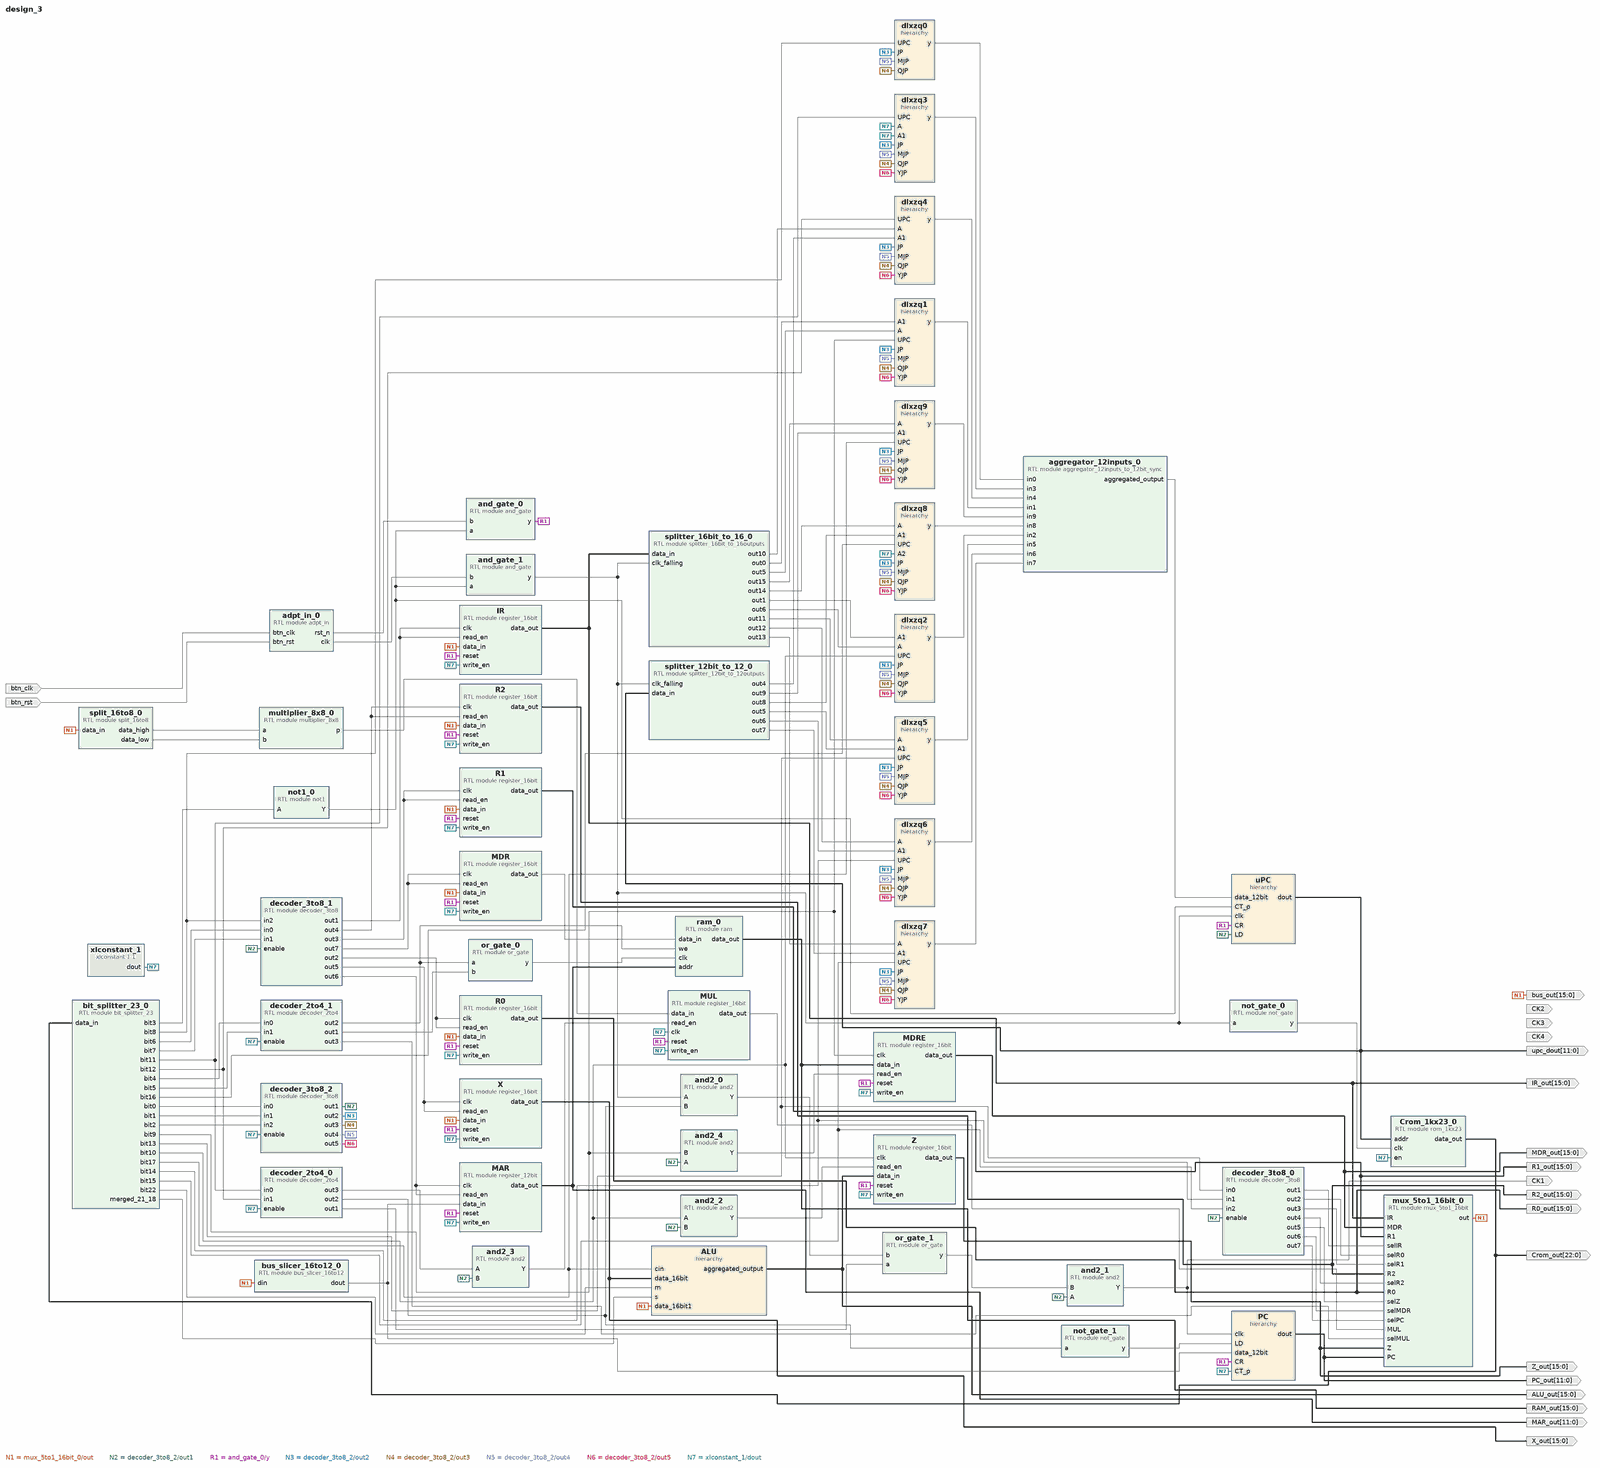
[diagram p0: block diagram of the top level, whole]
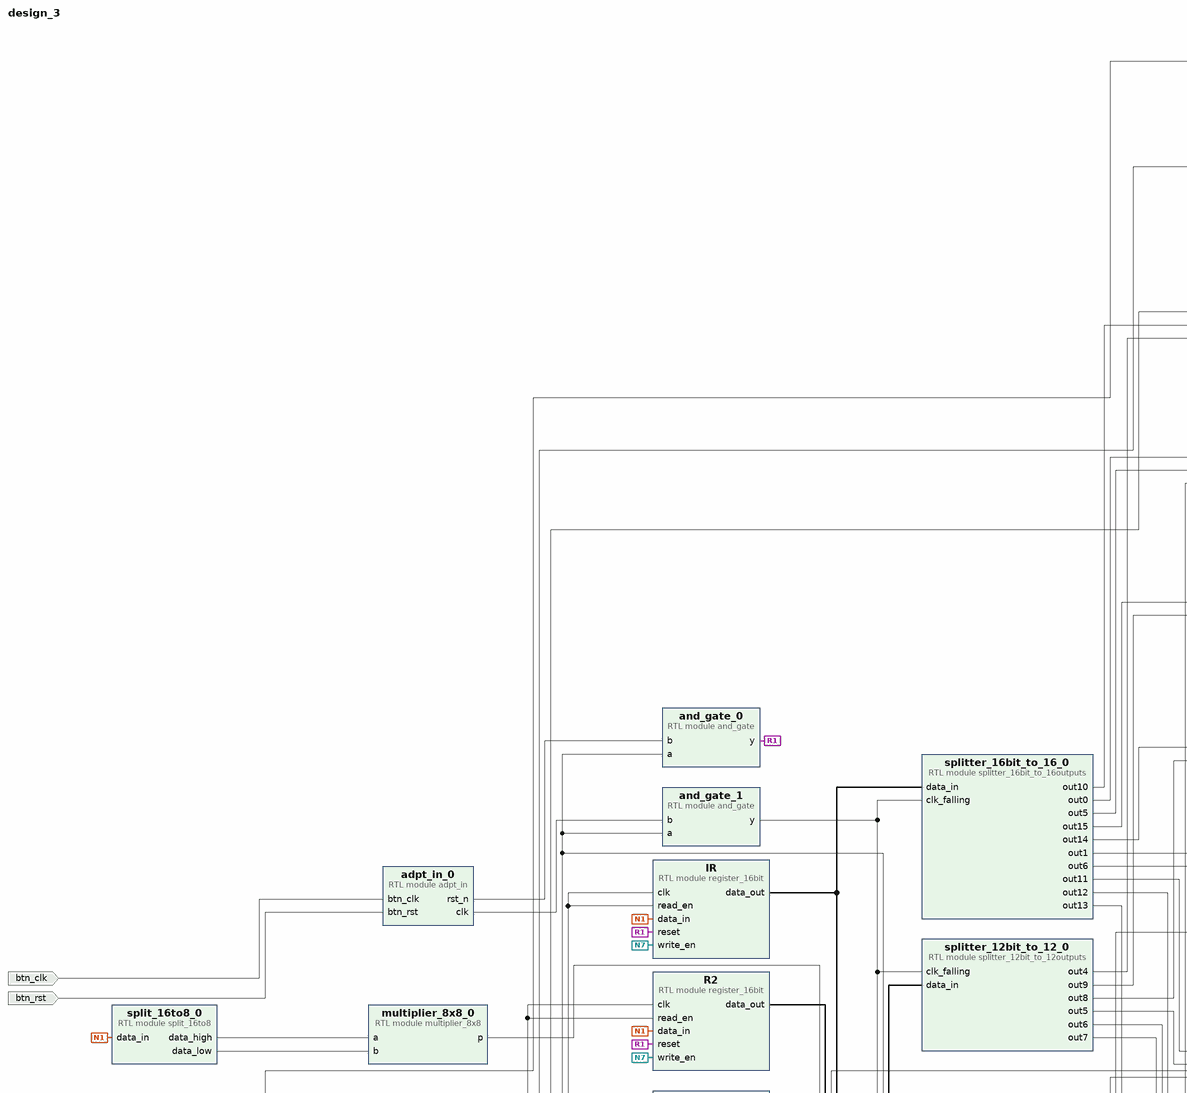
[diagram p1: block diagram of the top level, upper left part]
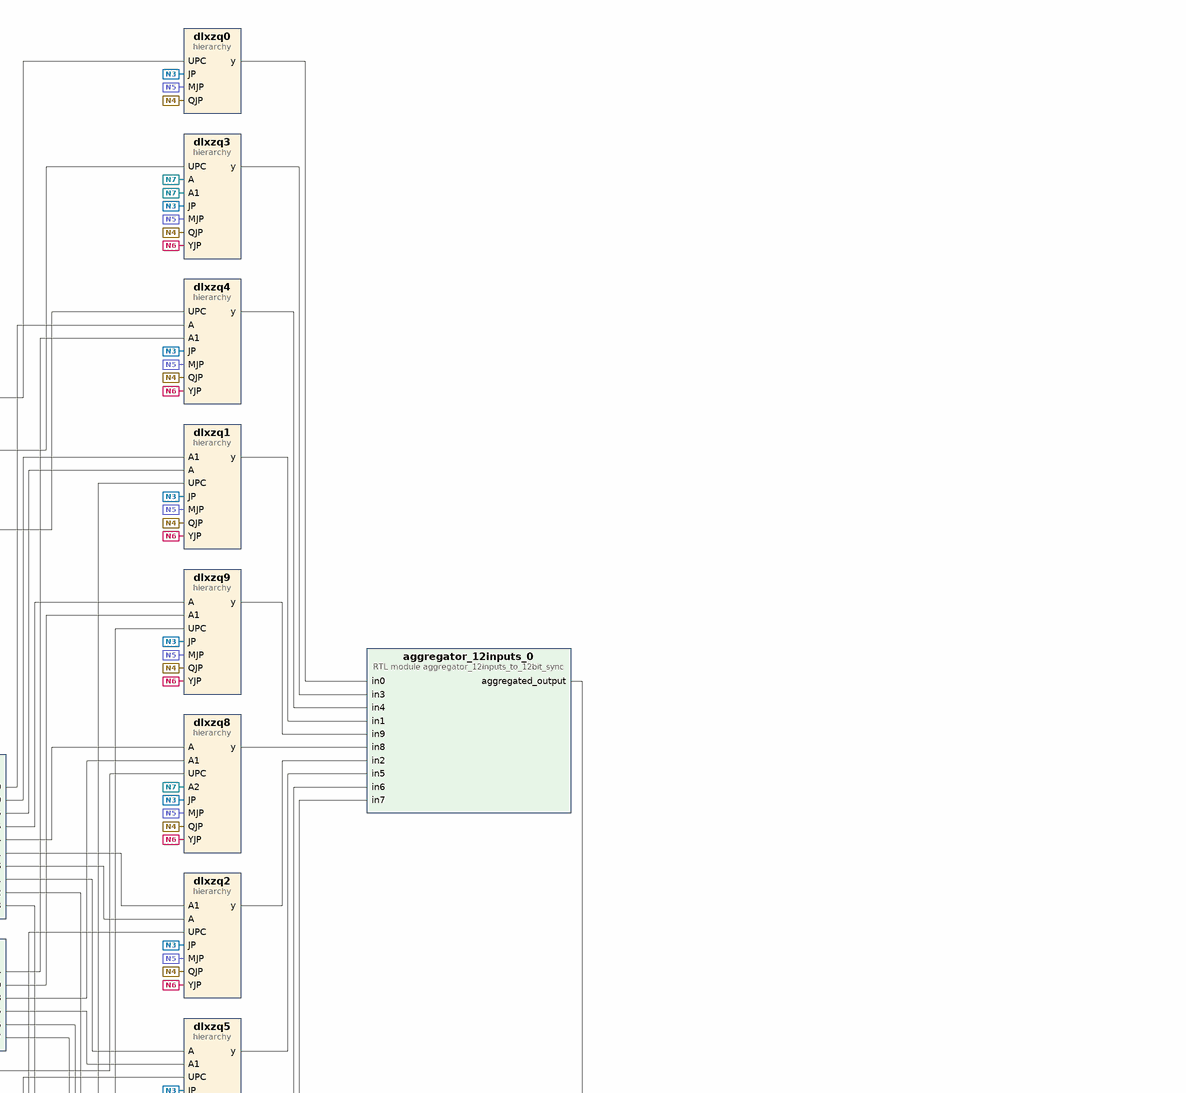
[diagram p2: block diagram of the top level, upper right part]
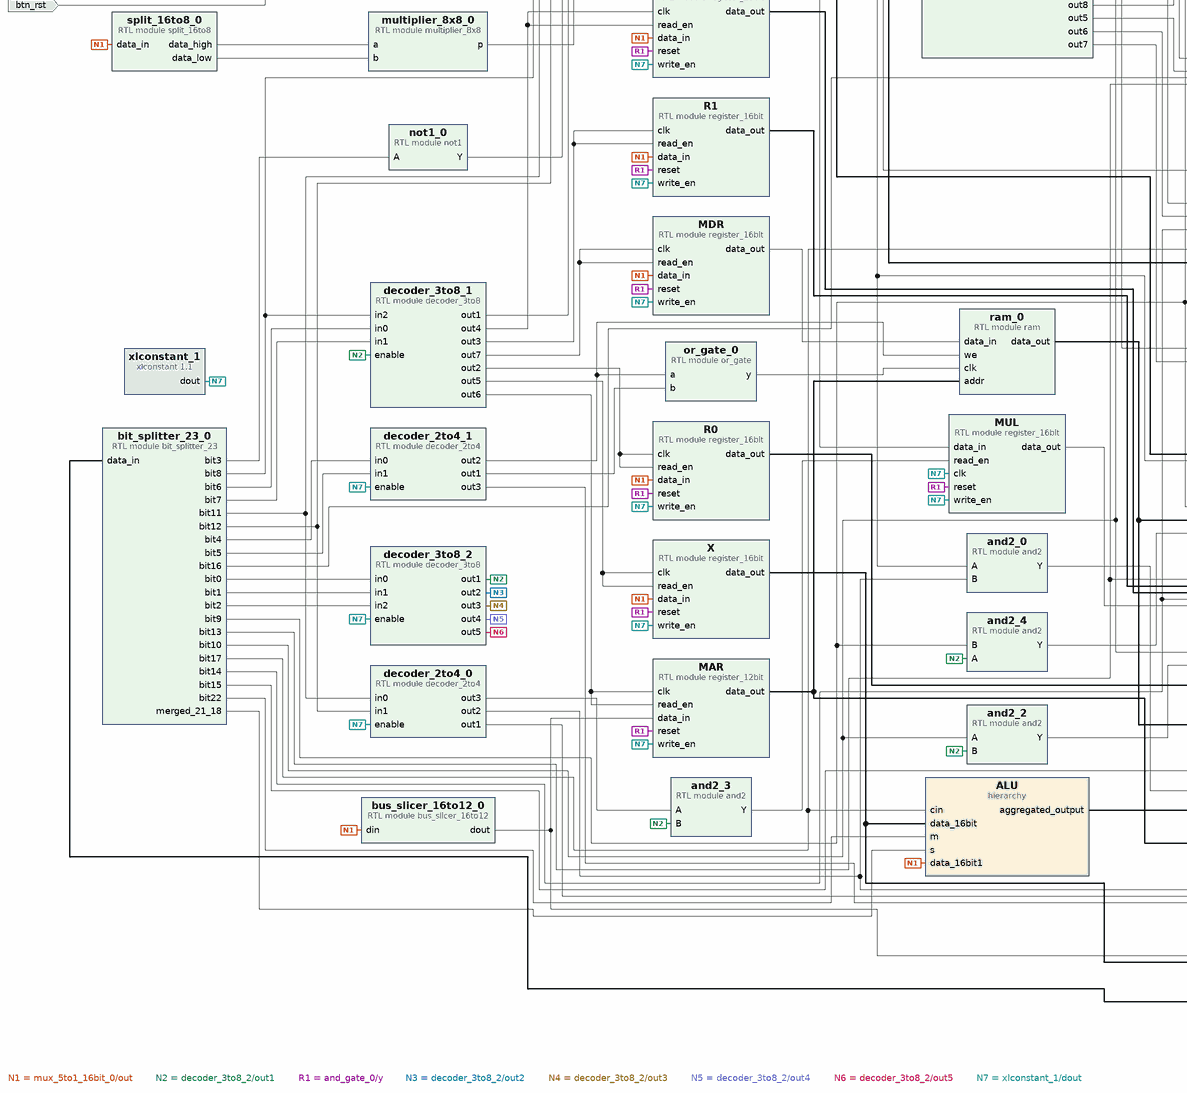
[diagram p3: block diagram of the top level, lower left part]
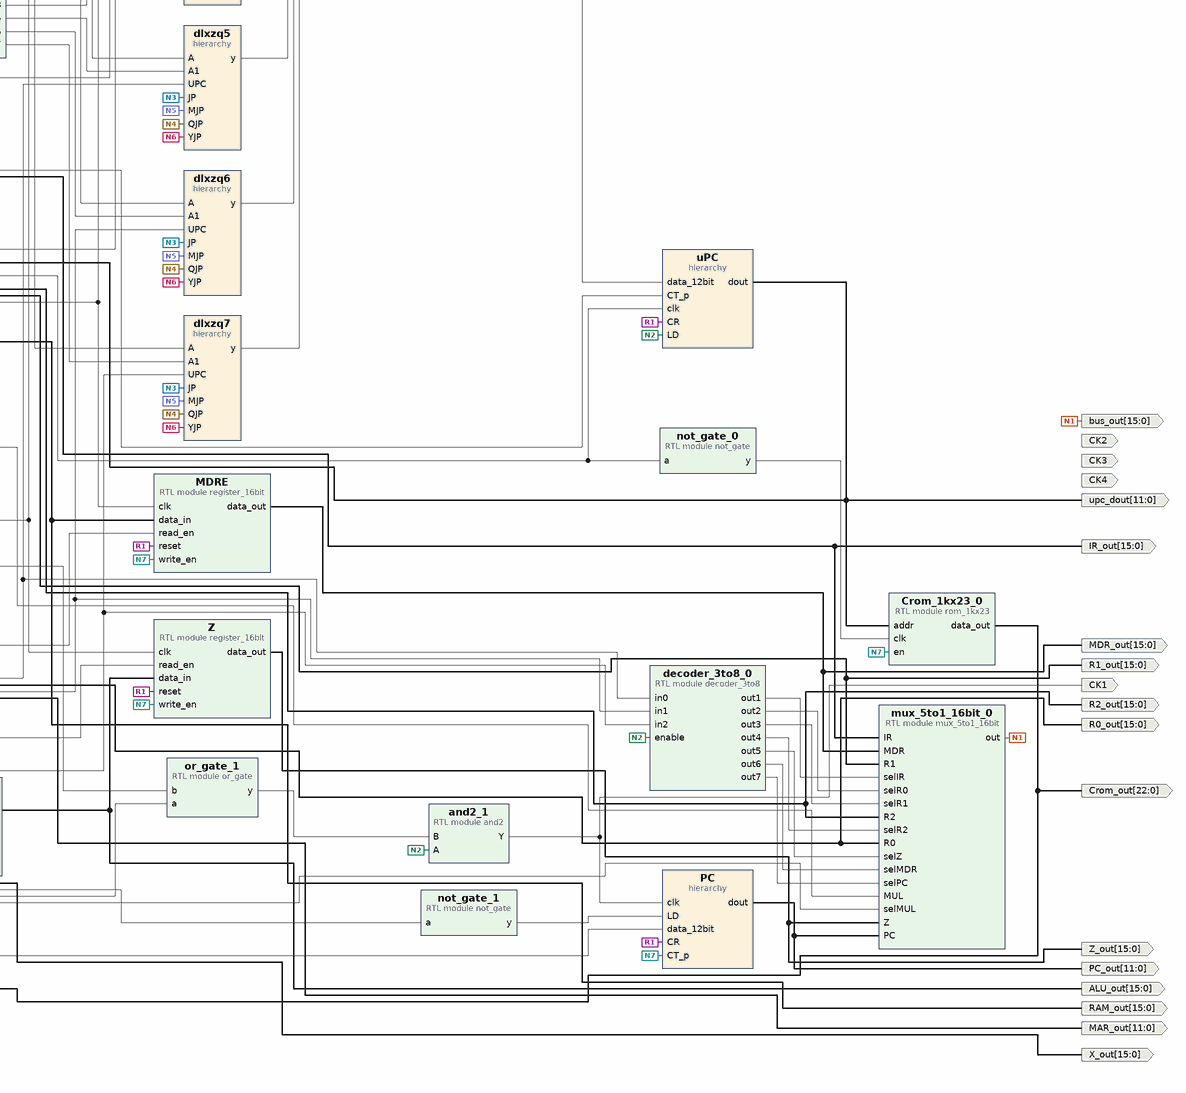
[diagram p4: block diagram of the top level, lower right part]
# Vivado block design design_3, xc7z020clg400-1, Vivado 2024.2
create_bd_design design_3

create_bd_port -dir I -type clk btn_clk
set_property -dict {CONFIG.FREQ_HZ 100000000} [get_bd_ports btn_clk]
create_bd_port -dir I -type rst btn_rst
create_bd_port -dir O -from 11 -to 0 upc_dout
create_bd_port -dir O -from 22 -to 0 Crom_out
create_bd_port -dir O -from 15 -to 0 bus_out
create_bd_port -dir O -from 11 -to 0 MAR_out
create_bd_port -dir O -from 11 -to 0 PC_out
create_bd_port -dir O -from 15 -to 0 RAM_out
create_bd_port -dir O -from 15 -to 0 IR_out
create_bd_port -dir O -from 15 -to 0 R2_out
create_bd_port -dir O -from 15 -to 0 R0_out
create_bd_port -dir O -from 15 -to 0 MDR_out
create_bd_port -dir O -from 15 -to 0 R1_out
create_bd_port -dir O -from 15 -to 0 X_out
create_bd_port -dir O CK1
create_bd_port -dir O -from 15 -to 0 ALU_out
create_bd_port -dir O CK2
create_bd_port -dir O CK3
create_bd_port -dir O CK4
create_bd_port -dir O -from 15 -to 0 Z_out

create_bd_cell -type module -reference adpt_in adpt_in_0
create_bd_cell -type ip -vlnv xilinx.com:ip:xlconstant:1.1 xlconstant_1
create_bd_cell -type hier PC
create_bd_cell -type module -reference ram ram_0
create_bd_cell -type module -reference register_16bit R0
create_bd_cell -type module -reference register_16bit R1
create_bd_cell -type module -reference register_16bit R2
create_bd_cell -type module -reference register_16bit X
create_bd_cell -type module -reference register_16bit Z
create_bd_cell -type module -reference register_12bit MAR
create_bd_cell -type module -reference register_16bit MDR
create_bd_cell -type module -reference register_16bit MDRE
create_bd_cell -type module -reference register_16bit IR
create_bd_cell -type module -reference mux_5to1_16bit mux_5to1_16bit_0
create_bd_cell -type hier ALU
create_bd_cell -type hier uPC
create_bd_cell -type module -reference rom_1kx23 Crom_1kx23_0
create_bd_cell -type module -reference bit_splitter_23 bit_splitter_23_0
create_bd_cell -type module -reference decoder_3to8 decoder_3to8_0
create_bd_cell -type module -reference decoder_2to4 decoder_2to4_0
create_bd_cell -type module -reference decoder_3to8 decoder_3to8_1
create_bd_cell -type module -reference decoder_2to4 decoder_2to4_1
create_bd_cell -type module -reference not1 not1_0
create_bd_cell -type module -reference decoder_3to8 decoder_3to8_2
create_bd_cell -type hier dlxzq0
create_bd_cell -type hier dlxzq1
create_bd_cell -type hier dlxzq2
create_bd_cell -type hier dlxzq3
create_bd_cell -type hier dlxzq4
create_bd_cell -type hier dlxzq5
create_bd_cell -type hier dlxzq6
create_bd_cell -type hier dlxzq7
create_bd_cell -type hier dlxzq8
create_bd_cell -type hier dlxzq9
create_bd_cell -type module -reference aggregator_12inputs_to_12bit_sync aggregator_12inputs_0
create_bd_cell -type module -reference splitter_16bit_to_16outputs splitter_16bit_to_16_0
create_bd_cell -type module -reference not_gate not_gate_0
create_bd_cell -type module -reference bus_slicer_16to12 bus_slicer_16to12_0
create_bd_cell -type module -reference or_gate or_gate_0
create_bd_cell -type module -reference and_gate and_gate_0
create_bd_cell -type module -reference and_gate and_gate_1
create_bd_cell -type module -reference not_gate not_gate_1
create_bd_cell -type module -reference or_gate or_gate_1
create_bd_cell -type module -reference and2 and2_0
create_bd_cell -type module -reference splitter_12bit_to_12outputs splitter_12bit_to_12_0
create_bd_cell -type module -reference and2 and2_1
create_bd_cell -type module -reference and2 and2_2
create_bd_cell -type module -reference multiplier_8x8 multiplier_8x8_0
create_bd_cell -type module -reference split_16to8 split_16to8_0
create_bd_cell -type module -reference register_16bit MUL
create_bd_cell -type module -reference and2 and2_3
create_bd_cell -type module -reference and2 and2_4

# ---- hierarchy /PC ----
current_bd_instance /PC
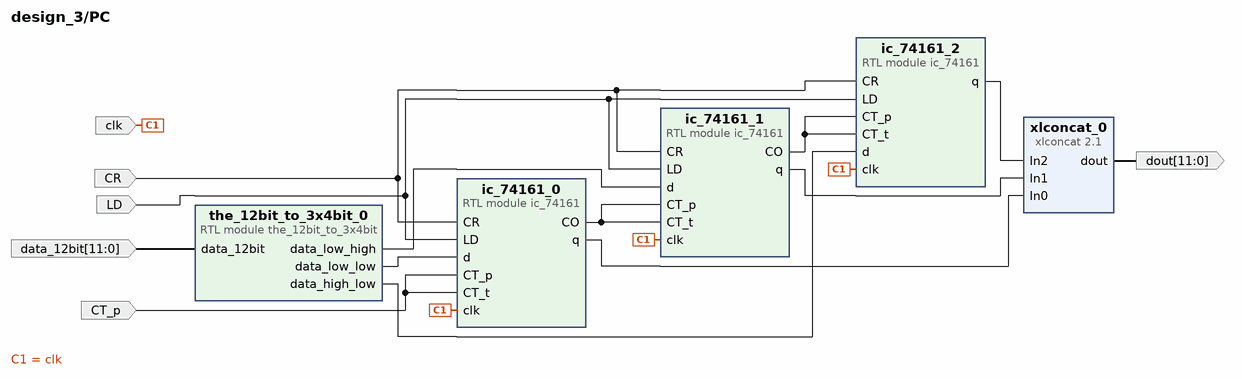
[diagram p5: block diagram inside /PC]
create_bd_pin -dir I CT_p
create_bd_pin -dir O -from 11 -to 0 dout
create_bd_pin -dir I -type clk clk
create_bd_pin -dir I CR
create_bd_pin -dir I -from 11 -to 0 data_12bit
create_bd_pin -dir I LD

create_bd_cell -type module -reference ic_74161 ic_74161_0
create_bd_cell -type module -reference ic_74161 ic_74161_1
create_bd_cell -type module -reference ic_74161 ic_74161_2
create_bd_cell -type ip -vlnv xilinx.com:ip:xlconcat:2.1 xlconcat_0
set_property -dict [list \
  CONFIG.IN0_WIDTH 4 \
  CONFIG.IN1_WIDTH 4 \
  CONFIG.IN2_WIDTH 4 \
  CONFIG.IN3_WIDTH 4 \
  CONFIG.NUM_PORTS 3 \
] [get_bd_cells xlconcat_0]
create_bd_cell -type module -reference the_12bit_to_3x4bit the_12bit_to_3x4bit_0

# ---- hierarchy /ALU ----
current_bd_instance /ALU
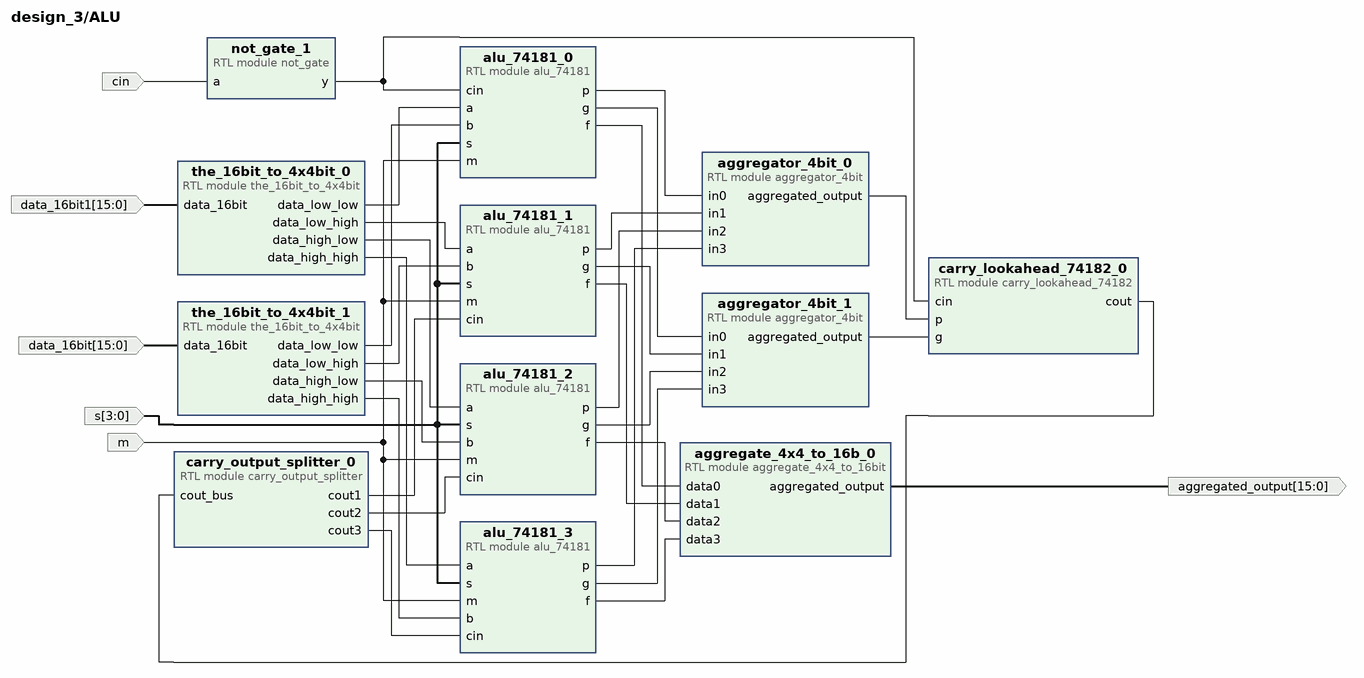
[diagram p6: block diagram inside /ALU]
create_bd_pin -dir I -from 15 -to 0 data_16bit
create_bd_pin -dir I -from 15 -to 0 data_16bit1
create_bd_pin -dir O -from 15 -to 0 aggregated_output
create_bd_pin -dir I m
create_bd_pin -dir I -from 3 -to 0 s
create_bd_pin -dir I cin

create_bd_cell -type module -reference aggregator_4bit aggregator_4bit_0
create_bd_cell -type module -reference carry_lookahead_74182 carry_lookahead_74182_0
create_bd_cell -type module -reference aggregator_4bit aggregator_4bit_1
create_bd_cell -type module -reference alu_74181 alu_74181_0
create_bd_cell -type module -reference alu_74181 alu_74181_1
create_bd_cell -type module -reference alu_74181 alu_74181_2
create_bd_cell -type module -reference aggregate_4x4_to_16bit aggregate_4x4_to_16b_0
create_bd_cell -type module -reference the_16bit_to_4x4bit the_16bit_to_4x4bit_1
create_bd_cell -type module -reference the_16bit_to_4x4bit the_16bit_to_4x4bit_0
create_bd_cell -type module -reference alu_74181 alu_74181_3
create_bd_cell -type module -reference carry_output_splitter carry_output_splitter_0
create_bd_cell -type module -reference not_gate not_gate_1

# ---- hierarchy /uPC ----
current_bd_instance /uPC
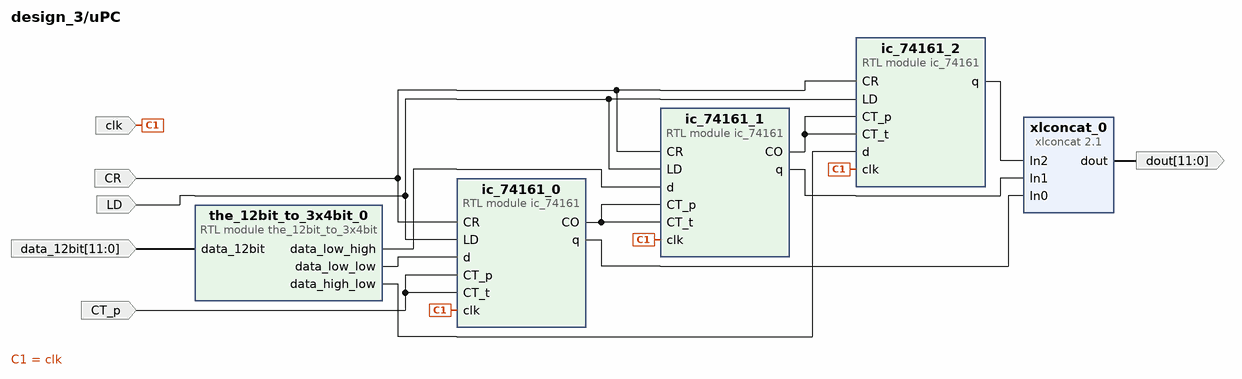
[diagram p7: block diagram inside /uPC]
create_bd_pin -dir I -type clk clk
create_bd_pin -dir I CT_p
create_bd_pin -dir O -from 11 -to 0 dout
create_bd_pin -dir I LD
create_bd_pin -dir I -from 11 -to 0 data_12bit
create_bd_pin -dir I CR

create_bd_cell -type module -reference ic_74161 ic_74161_0
create_bd_cell -type module -reference ic_74161 ic_74161_1
create_bd_cell -type module -reference ic_74161 ic_74161_2
create_bd_cell -type ip -vlnv xilinx.com:ip:xlconcat:2.1 xlconcat_0
set_property -dict [list \
  CONFIG.IN0_WIDTH 4 \
  CONFIG.IN1_WIDTH 4 \
  CONFIG.IN2_WIDTH 4 \
  CONFIG.IN3_WIDTH 4 \
  CONFIG.NUM_PORTS 3 \
] [get_bd_cells xlconcat_0]
create_bd_cell -type module -reference the_12bit_to_3x4bit the_12bit_to_3x4bit_0

# ---- hierarchy /dlxzq0 ----
current_bd_instance /dlxzq0
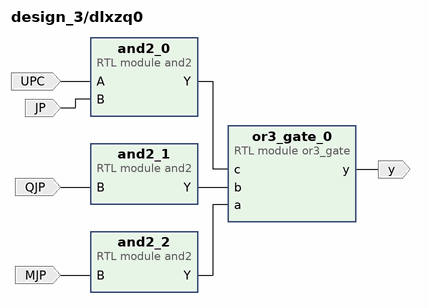
[diagram p8: block diagram inside /dlxzq0]
create_bd_pin -dir I QJP
create_bd_pin -dir I MJP
create_bd_pin -dir I UPC
create_bd_pin -dir I JP
create_bd_pin -dir O y

create_bd_cell -type module -reference and2 and2_1
create_bd_cell -type module -reference and2 and2_2
create_bd_cell -type module -reference or3_gate or3_gate_0
create_bd_cell -type module -reference and2 and2_0

# ---- hierarchy /dlxzq1 ----
current_bd_instance /dlxzq1
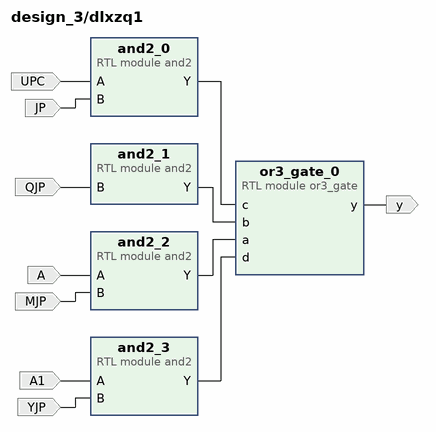
[diagram p9: block diagram inside /dlxzq1]
create_bd_pin -dir I QJP
create_bd_pin -dir I MJP
create_bd_pin -dir I UPC
create_bd_pin -dir I JP
create_bd_pin -dir O y
create_bd_pin -dir I A
create_bd_pin -dir I YJP
create_bd_pin -dir I A1

create_bd_cell -type module -reference and2 and2_1
create_bd_cell -type module -reference and2 and2_2
create_bd_cell -type module -reference or3_gate or3_gate_0
create_bd_cell -type module -reference and2 and2_0
create_bd_cell -type module -reference and2 and2_3

# ---- hierarchy /dlxzq2 ----
current_bd_instance /dlxzq2
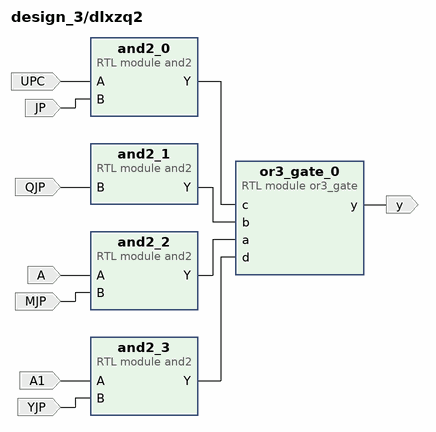
[diagram p10: block diagram inside /dlxzq2]
create_bd_pin -dir I QJP
create_bd_pin -dir I MJP
create_bd_pin -dir I UPC
create_bd_pin -dir I JP
create_bd_pin -dir O y
create_bd_pin -dir I A
create_bd_pin -dir I YJP
create_bd_pin -dir I A1

create_bd_cell -type module -reference and2 and2_1
create_bd_cell -type module -reference and2 and2_2
create_bd_cell -type module -reference or3_gate or3_gate_0
create_bd_cell -type module -reference and2 and2_0
create_bd_cell -type module -reference and2 and2_3

# ---- hierarchy /dlxzq3 ----
current_bd_instance /dlxzq3
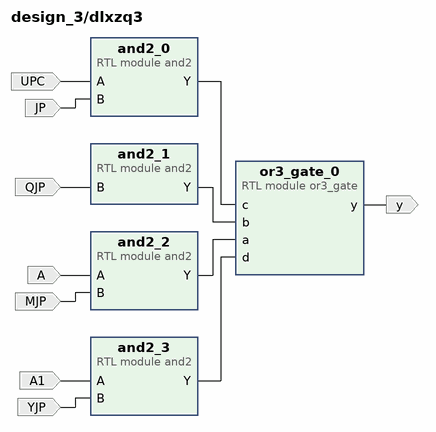
[diagram p11: block diagram inside /dlxzq3]
create_bd_pin -dir I QJP
create_bd_pin -dir I MJP
create_bd_pin -dir I UPC
create_bd_pin -dir I JP
create_bd_pin -dir O y
create_bd_pin -dir I A
create_bd_pin -dir I YJP
create_bd_pin -dir I A1

create_bd_cell -type module -reference and2 and2_1
create_bd_cell -type module -reference and2 and2_2
create_bd_cell -type module -reference or3_gate or3_gate_0
create_bd_cell -type module -reference and2 and2_0
create_bd_cell -type module -reference and2 and2_3

# ---- hierarchy /dlxzq4 ----
current_bd_instance /dlxzq4
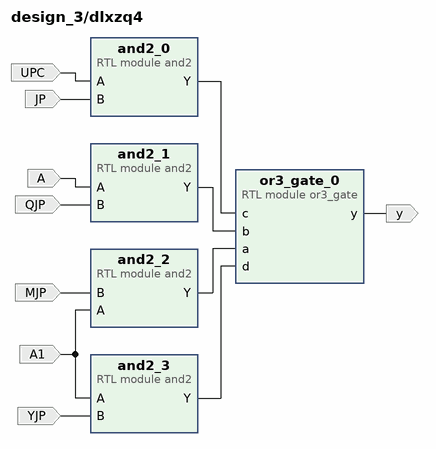
[diagram p12: block diagram inside /dlxzq4]
create_bd_pin -dir I QJP
create_bd_pin -dir I MJP
create_bd_pin -dir I UPC
create_bd_pin -dir I JP
create_bd_pin -dir O y
create_bd_pin -dir I A
create_bd_pin -dir I A1
create_bd_pin -dir I YJP

create_bd_cell -type module -reference and2 and2_1
create_bd_cell -type module -reference and2 and2_2
create_bd_cell -type module -reference or3_gate or3_gate_0
create_bd_cell -type module -reference and2 and2_0
create_bd_cell -type module -reference and2 and2_3

# ---- hierarchy /dlxzq5 ----
current_bd_instance /dlxzq5
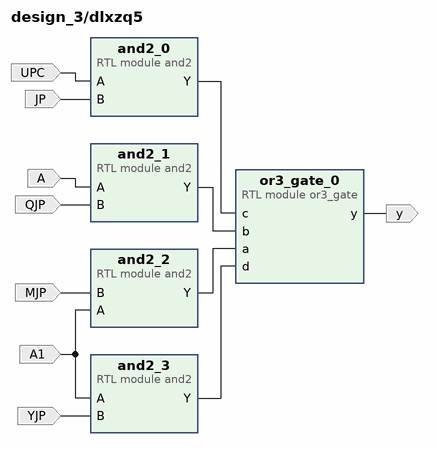
[diagram p13: block diagram inside /dlxzq5]
create_bd_pin -dir I QJP
create_bd_pin -dir I MJP
create_bd_pin -dir I UPC
create_bd_pin -dir I JP
create_bd_pin -dir O y
create_bd_pin -dir I A
create_bd_pin -dir I A1
create_bd_pin -dir I YJP

create_bd_cell -type module -reference and2 and2_1
create_bd_cell -type module -reference and2 and2_2
create_bd_cell -type module -reference or3_gate or3_gate_0
create_bd_cell -type module -reference and2 and2_0
create_bd_cell -type module -reference and2 and2_3

# ---- hierarchy /dlxzq6 ----
current_bd_instance /dlxzq6
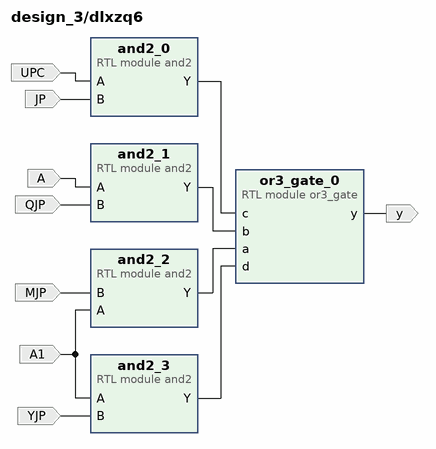
[diagram p14: block diagram inside /dlxzq6]
create_bd_pin -dir I QJP
create_bd_pin -dir I MJP
create_bd_pin -dir I UPC
create_bd_pin -dir I JP
create_bd_pin -dir O y
create_bd_pin -dir I A
create_bd_pin -dir I A1
create_bd_pin -dir I YJP

create_bd_cell -type module -reference and2 and2_1
create_bd_cell -type module -reference and2 and2_2
create_bd_cell -type module -reference or3_gate or3_gate_0
create_bd_cell -type module -reference and2 and2_0
create_bd_cell -type module -reference and2 and2_3

# ---- hierarchy /dlxzq7 ----
current_bd_instance /dlxzq7
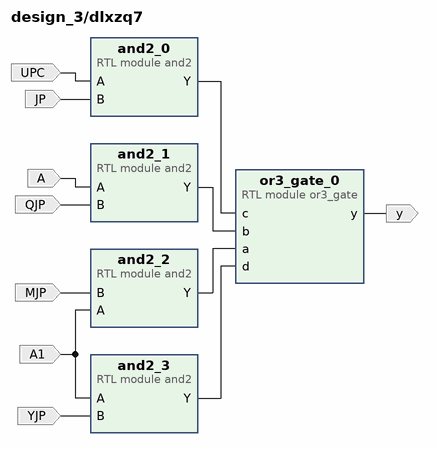
[diagram p15: block diagram inside /dlxzq7]
create_bd_pin -dir I QJP
create_bd_pin -dir I MJP
create_bd_pin -dir I UPC
create_bd_pin -dir I JP
create_bd_pin -dir O y
create_bd_pin -dir I A
create_bd_pin -dir I A1
create_bd_pin -dir I YJP

create_bd_cell -type module -reference and2 and2_1
create_bd_cell -type module -reference and2 and2_2
create_bd_cell -type module -reference or3_gate or3_gate_0
create_bd_cell -type module -reference and2 and2_0
create_bd_cell -type module -reference and2 and2_3

# ---- hierarchy /dlxzq8 ----
current_bd_instance /dlxzq8
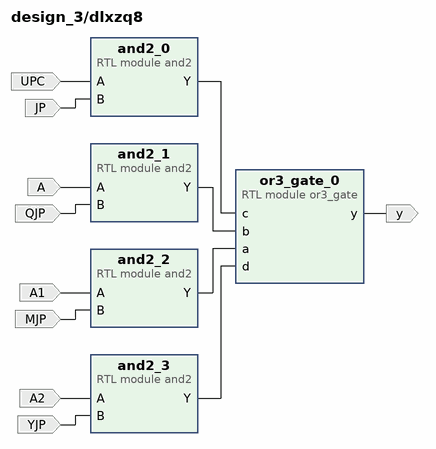
[diagram p16: block diagram inside /dlxzq8]
create_bd_pin -dir I QJP
create_bd_pin -dir I MJP
create_bd_pin -dir I UPC
create_bd_pin -dir I JP
create_bd_pin -dir O y
create_bd_pin -dir I A
create_bd_pin -dir I A1
create_bd_pin -dir I YJP
create_bd_pin -dir I A2

create_bd_cell -type module -reference and2 and2_1
create_bd_cell -type module -reference and2 and2_2
create_bd_cell -type module -reference or3_gate or3_gate_0
create_bd_cell -type module -reference and2 and2_0
create_bd_cell -type module -reference and2 and2_3

# ---- hierarchy /dlxzq9 ----
current_bd_instance /dlxzq9
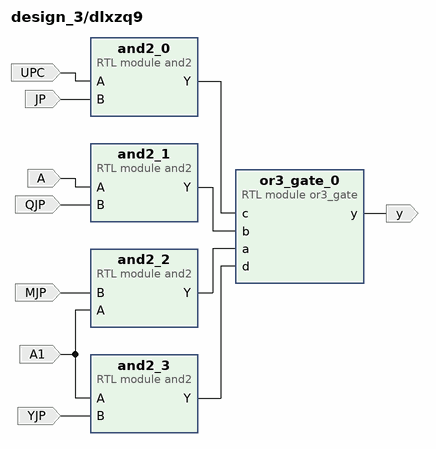
[diagram p17: block diagram inside /dlxzq9]
create_bd_pin -dir I QJP
create_bd_pin -dir I MJP
create_bd_pin -dir I UPC
create_bd_pin -dir I JP
create_bd_pin -dir O y
create_bd_pin -dir I A
create_bd_pin -dir I A1
create_bd_pin -dir I YJP

create_bd_cell -type module -reference and2 and2_1
create_bd_cell -type module -reference and2 and2_2
create_bd_cell -type module -reference or3_gate or3_gate_0
create_bd_cell -type module -reference and2 and2_0
create_bd_cell -type module -reference and2 and2_3

# ---- connections ----

current_bd_instance /PC
connect_bd_net [get_bd_pins CR] [get_bd_pins ic_74161_0/CR] [get_bd_pins ic_74161_1/CR] [get_bd_pins ic_74161_2/CR]
connect_bd_net [get_bd_pins LD] [get_bd_pins ic_74161_1/LD] [get_bd_pins ic_74161_2/LD] [get_bd_pins ic_74161_0/LD]
connect_bd_net -net adpt_in_0_clk [get_bd_pins clk] [get_bd_pins ic_74161_0/clk] [get_bd_pins ic_74161_1/clk] [get_bd_pins ic_74161_2/clk]
connect_bd_net [get_bd_pins data_12bit] [get_bd_pins the_12bit_to_3x4bit_0/data_12bit]
connect_bd_net [get_bd_pins ic_74161_0/CO] [get_bd_pins ic_74161_1/CT_p] [get_bd_pins ic_74161_1/CT_t]
connect_bd_net [get_bd_pins ic_74161_0/q] [get_bd_pins xlconcat_0/In0]
connect_bd_net [get_bd_pins ic_74161_1/CO] [get_bd_pins ic_74161_2/CT_p] [get_bd_pins ic_74161_2/CT_t]
connect_bd_net [get_bd_pins ic_74161_1/q] [get_bd_pins xlconcat_0/In1]
connect_bd_net [get_bd_pins ic_74161_2/q] [get_bd_pins xlconcat_0/In2]
connect_bd_net [get_bd_pins the_12bit_to_3x4bit_0/data_high_low] [get_bd_pins ic_74161_2/d]
connect_bd_net [get_bd_pins the_12bit_to_3x4bit_0/data_low_high] [get_bd_pins ic_74161_1/d]
connect_bd_net [get_bd_pins the_12bit_to_3x4bit_0/data_low_low] [get_bd_pins ic_74161_0/d]
connect_bd_net [get_bd_pins xlconcat_0/dout] [get_bd_pins dout]
connect_bd_net -net xlconstant_0_dout [get_bd_pins CT_p] [get_bd_pins ic_74161_0/CT_p] [get_bd_pins ic_74161_0/CT_t]

current_bd_instance /ALU
connect_bd_net -net Busline_0_data_out [get_bd_pins data_16bit1] [get_bd_pins the_16bit_to_4x4bit_0/data_16bit]
connect_bd_net [get_bd_pins cin] [get_bd_pins not_gate_1/a]
connect_bd_net [get_bd_pins s] [get_bd_pins alu_74181_0/s] [get_bd_pins alu_74181_1/s] [get_bd_pins alu_74181_2/s] [get_bd_pins alu_74181_3/s]
connect_bd_net [get_bd_pins m] [get_bd_pins alu_74181_0/m] [get_bd_pins alu_74181_1/m] [get_bd_pins alu_74181_2/m] [get_bd_pins alu_74181_3/m]
connect_bd_net -net X_data_out [get_bd_pins data_16bit] [get_bd_pins the_16bit_to_4x4bit_1/data_16bit]
connect_bd_net [get_bd_pins aggregate_4x4_to_16b_0/aggregated_output] [get_bd_pins aggregated_output]
connect_bd_net [get_bd_pins aggregator_4bit_0/aggregated_output] [get_bd_pins carry_lookahead_74182_0/p]
connect_bd_net [get_bd_pins aggregator_4bit_1/aggregated_output] [get_bd_pins carry_lookahead_74182_0/g]
connect_bd_net [get_bd_pins alu_74181_0/f] [get_bd_pins aggregate_4x4_to_16b_0/data0]
connect_bd_net [get_bd_pins alu_74181_0/g] [get_bd_pins aggregator_4bit_1/in0]
connect_bd_net [get_bd_pins alu_74181_0/p] [get_bd_pins aggregator_4bit_0/in0]
connect_bd_net [get_bd_pins alu_74181_1/f] [get_bd_pins aggregate_4x4_to_16b_0/data1]
connect_bd_net [get_bd_pins alu_74181_1/g] [get_bd_pins aggregator_4bit_1/in1]
connect_bd_net [get_bd_pins alu_74181_1/p] [get_bd_pins aggregator_4bit_0/in1]
connect_bd_net [get_bd_pins alu_74181_2/f] [get_bd_pins aggregate_4x4_to_16b_0/data2]
connect_bd_net [get_bd_pins alu_74181_2/g] [get_bd_pins aggregator_4bit_1/in2]
connect_bd_net [get_bd_pins alu_74181_2/p] [get_bd_pins aggregator_4bit_0/in2]
connect_bd_net [get_bd_pins alu_74181_3/f] [get_bd_pins aggregate_4x4_to_16b_0/data3]
connect_bd_net [get_bd_pins alu_74181_3/g] [get_bd_pins aggregator_4bit_1/in3]
connect_bd_net [get_bd_pins alu_74181_3/p] [get_bd_pins aggregator_4bit_0/in3]
connect_bd_net [get_bd_pins carry_lookahead_74182_0/cout] [get_bd_pins carry_output_splitter_0/cout_bus]
connect_bd_net [get_bd_pins carry_output_splitter_0/cout1] [get_bd_pins alu_74181_1/cin]
connect_bd_net [get_bd_pins carry_output_splitter_0/cout2] [get_bd_pins alu_74181_2/cin]
connect_bd_net [get_bd_pins carry_output_splitter_0/cout3] [get_bd_pins alu_74181_3/cin]
connect_bd_net [get_bd_pins not_gate_1/y] [get_bd_pins alu_74181_0/cin] [get_bd_pins carry_lookahead_74182_0/cin]
connect_bd_net [get_bd_pins the_16bit_to_4x4bit_1/data_high_high] [get_bd_pins alu_74181_3/b]
connect_bd_net [get_bd_pins the_16bit_to_4x4bit_1/data_high_low] [get_bd_pins alu_74181_2/b]
connect_bd_net [get_bd_pins the_16bit_to_4x4bit_1/data_low_high] [get_bd_pins alu_74181_1/b]
connect_bd_net [get_bd_pins the_16bit_to_4x4bit_1/data_low_low] [get_bd_pins alu_74181_0/b]
connect_bd_net -net the_16bit_to_4x4bit_2_data_high_high [get_bd_pins the_16bit_to_4x4bit_0/data_high_high] [get_bd_pins alu_74181_3/a]
connect_bd_net -net the_16bit_to_4x4bit_2_data_high_low [get_bd_pins the_16bit_to_4x4bit_0/data_high_low] [get_bd_pins alu_74181_2/a]
connect_bd_net -net the_16bit_to_4x4bit_2_data_low_high [get_bd_pins the_16bit_to_4x4bit_0/data_low_high] [get_bd_pins alu_74181_1/a]
connect_bd_net -net the_16bit_to_4x4bit_2_data_low_low [get_bd_pins the_16bit_to_4x4bit_0/data_low_low] [get_bd_pins alu_74181_0/a]

current_bd_instance /uPC
connect_bd_net [get_bd_pins CR] [get_bd_pins ic_74161_0/CR] [get_bd_pins ic_74161_1/CR] [get_bd_pins ic_74161_2/CR]
connect_bd_net [get_bd_pins LD] [get_bd_pins ic_74161_0/LD] [get_bd_pins ic_74161_1/LD] [get_bd_pins ic_74161_2/LD]
connect_bd_net -net adpt_in_0_clk [get_bd_pins clk] [get_bd_pins ic_74161_0/clk] [get_bd_pins ic_74161_1/clk] [get_bd_pins ic_74161_2/clk]
connect_bd_net [get_bd_pins data_12bit] [get_bd_pins the_12bit_to_3x4bit_0/data_12bit]
connect_bd_net [get_bd_pins ic_74161_0/CO] [get_bd_pins ic_74161_1/CT_p] [get_bd_pins ic_74161_1/CT_t]
connect_bd_net [get_bd_pins ic_74161_0/q] [get_bd_pins xlconcat_0/In0]
connect_bd_net [get_bd_pins ic_74161_1/CO] [get_bd_pins ic_74161_2/CT_p] [get_bd_pins ic_74161_2/CT_t]
connect_bd_net [get_bd_pins ic_74161_1/q] [get_bd_pins xlconcat_0/In1]
connect_bd_net [get_bd_pins ic_74161_2/q] [get_bd_pins xlconcat_0/In2]
connect_bd_net [get_bd_pins the_12bit_to_3x4bit_0/data_high_low] [get_bd_pins ic_74161_2/d]
connect_bd_net [get_bd_pins the_12bit_to_3x4bit_0/data_low_high] [get_bd_pins ic_74161_1/d]
connect_bd_net [get_bd_pins the_12bit_to_3x4bit_0/data_low_low] [get_bd_pins ic_74161_0/d]
connect_bd_net [get_bd_pins xlconcat_0/dout] [get_bd_pins dout]
connect_bd_net -net xlconstant_0_dout [get_bd_pins CT_p] [get_bd_pins ic_74161_0/CT_p] [get_bd_pins ic_74161_0/CT_t]

current_bd_instance /dlxzq0
connect_bd_net [get_bd_pins and2_0/Y] [get_bd_pins or3_gate_0/c]
connect_bd_net [get_bd_pins and2_1/Y] [get_bd_pins or3_gate_0/b]
connect_bd_net [get_bd_pins and2_2/Y] [get_bd_pins or3_gate_0/a]
connect_bd_net -net bit_splitter_23_0_bit8 [get_bd_pins UPC] [get_bd_pins and2_0/A]
connect_bd_net -net decoder_3to8_2_out2 [get_bd_pins JP] [get_bd_pins and2_0/B]
connect_bd_net -net decoder_3to8_2_out3 [get_bd_pins QJP] [get_bd_pins and2_1/B]
connect_bd_net -net decoder_3to8_2_out4 [get_bd_pins MJP] [get_bd_pins and2_2/B]
connect_bd_net [get_bd_pins or3_gate_0/y] [get_bd_pins y]

current_bd_instance /dlxzq1
connect_bd_net -net A1_1 [get_bd_pins A1] [get_bd_pins and2_3/A]
connect_bd_net [get_bd_pins A] [get_bd_pins and2_2/A]
connect_bd_net -net B_1 [get_bd_pins YJP] [get_bd_pins and2_3/B]
connect_bd_net [get_bd_pins and2_0/Y] [get_bd_pins or3_gate_0/c]
connect_bd_net [get_bd_pins and2_1/Y] [get_bd_pins or3_gate_0/b]
connect_bd_net [get_bd_pins and2_2/Y] [get_bd_pins or3_gate_0/a]
connect_bd_net [get_bd_pins and2_3/Y] [get_bd_pins or3_gate_0/d]
connect_bd_net -net bit_splitter_23_0_bit8 [get_bd_pins UPC] [get_bd_pins and2_0/A]
connect_bd_net -net decoder_3to8_2_out2 [get_bd_pins JP] [get_bd_pins and2_0/B]
connect_bd_net -net decoder_3to8_2_out3 [get_bd_pins QJP] [get_bd_pins and2_1/B]
connect_bd_net -net decoder_3to8_2_out4 [get_bd_pins MJP] [get_bd_pins and2_2/B]
connect_bd_net [get_bd_pins or3_gate_0/y] [get_bd_pins y]

current_bd_instance /dlxzq2
connect_bd_net -net A1_1 [get_bd_pins A1] [get_bd_pins and2_3/A]
connect_bd_net [get_bd_pins A] [get_bd_pins and2_2/A]
connect_bd_net -net B_1 [get_bd_pins YJP] [get_bd_pins and2_3/B]
connect_bd_net [get_bd_pins and2_0/Y] [get_bd_pins or3_gate_0/c]
connect_bd_net [get_bd_pins and2_1/Y] [get_bd_pins or3_gate_0/b]
connect_bd_net [get_bd_pins and2_2/Y] [get_bd_pins or3_gate_0/a]
connect_bd_net [get_bd_pins and2_3/Y] [get_bd_pins or3_gate_0/d]
connect_bd_net -net bit_splitter_23_0_bit8 [get_bd_pins UPC] [get_bd_pins and2_0/A]
connect_bd_net -net decoder_3to8_2_out2 [get_bd_pins JP] [get_bd_pins and2_0/B]
connect_bd_net -net decoder_3to8_2_out3 [get_bd_pins QJP] [get_bd_pins and2_1/B]
connect_bd_net -net decoder_3to8_2_out4 [get_bd_pins MJP] [get_bd_pins and2_2/B]
connect_bd_net [get_bd_pins or3_gate_0/y] [get_bd_pins y]

current_bd_instance /dlxzq3
connect_bd_net -net A1_1 [get_bd_pins A1] [get_bd_pins and2_3/A]
connect_bd_net [get_bd_pins A] [get_bd_pins and2_2/A]
connect_bd_net -net B_1 [get_bd_pins YJP] [get_bd_pins and2_3/B]
connect_bd_net [get_bd_pins and2_0/Y] [get_bd_pins or3_gate_0/c]
connect_bd_net [get_bd_pins and2_1/Y] [get_bd_pins or3_gate_0/b]
connect_bd_net [get_bd_pins and2_2/Y] [get_bd_pins or3_gate_0/a]
connect_bd_net [get_bd_pins and2_3/Y] [get_bd_pins or3_gate_0/d]
connect_bd_net -net bit_splitter_23_0_bit8 [get_bd_pins UPC] [get_bd_pins and2_0/A]
connect_bd_net -net decoder_3to8_2_out2 [get_bd_pins JP] [get_bd_pins and2_0/B]
connect_bd_net -net decoder_3to8_2_out3 [get_bd_pins QJP] [get_bd_pins and2_1/B]
connect_bd_net -net decoder_3to8_2_out4 [get_bd_pins MJP] [get_bd_pins and2_2/B]
connect_bd_net [get_bd_pins or3_gate_0/y] [get_bd_pins y]

current_bd_instance /dlxzq4
connect_bd_net -net A1_1 [get_bd_pins A1] [get_bd_pins and2_3/A] [get_bd_pins and2_2/A]
connect_bd_net [get_bd_pins A] [get_bd_pins and2_1/A]
connect_bd_net -net B_1 [get_bd_pins YJP] [get_bd_pins and2_3/B]
connect_bd_net [get_bd_pins and2_0/Y] [get_bd_pins or3_gate_0/c]
connect_bd_net [get_bd_pins and2_1/Y] [get_bd_pins or3_gate_0/b]
connect_bd_net [get_bd_pins and2_2/Y] [get_bd_pins or3_gate_0/a]
connect_bd_net [get_bd_pins and2_3/Y] [get_bd_pins or3_gate_0/d]
connect_bd_net -net bit_splitter_23_0_bit8 [get_bd_pins UPC] [get_bd_pins and2_0/A]
connect_bd_net -net decoder_3to8_2_out2 [get_bd_pins JP] [get_bd_pins and2_0/B]
connect_bd_net -net decoder_3to8_2_out3 [get_bd_pins QJP] [get_bd_pins and2_1/B]
connect_bd_net -net decoder_3to8_2_out4 [get_bd_pins MJP] [get_bd_pins and2_2/B]
connect_bd_net [get_bd_pins or3_gate_0/y] [get_bd_pins y]

current_bd_instance /dlxzq5
connect_bd_net -net A1_1 [get_bd_pins A1] [get_bd_pins and2_2/A] [get_bd_pins and2_3/A]
connect_bd_net [get_bd_pins A] [get_bd_pins and2_1/A]
connect_bd_net -net B_1 [get_bd_pins YJP] [get_bd_pins and2_3/B]
connect_bd_net [get_bd_pins and2_0/Y] [get_bd_pins or3_gate_0/c]
connect_bd_net [get_bd_pins and2_1/Y] [get_bd_pins or3_gate_0/b]
connect_bd_net [get_bd_pins and2_2/Y] [get_bd_pins or3_gate_0/a]
connect_bd_net [get_bd_pins and2_3/Y] [get_bd_pins or3_gate_0/d]
connect_bd_net -net bit_splitter_23_0_bit8 [get_bd_pins UPC] [get_bd_pins and2_0/A]
connect_bd_net -net decoder_3to8_2_out2 [get_bd_pins JP] [get_bd_pins and2_0/B]
connect_bd_net -net decoder_3to8_2_out3 [get_bd_pins QJP] [get_bd_pins and2_1/B]
connect_bd_net -net decoder_3to8_2_out4 [get_bd_pins MJP] [get_bd_pins and2_2/B]
connect_bd_net [get_bd_pins or3_gate_0/y] [get_bd_pins y]

current_bd_instance /dlxzq6
connect_bd_net -net A1_1 [get_bd_pins A1] [get_bd_pins and2_2/A] [get_bd_pins and2_3/A]
connect_bd_net [get_bd_pins A] [get_bd_pins and2_1/A]
connect_bd_net -net B_1 [get_bd_pins YJP] [get_bd_pins and2_3/B]
connect_bd_net [get_bd_pins and2_0/Y] [get_bd_pins or3_gate_0/c]
connect_bd_net [get_bd_pins and2_1/Y] [get_bd_pins or3_gate_0/b]
connect_bd_net [get_bd_pins and2_2/Y] [get_bd_pins or3_gate_0/a]
connect_bd_net [get_bd_pins and2_3/Y] [get_bd_pins or3_gate_0/d]
connect_bd_net -net bit_splitter_23_0_bit8 [get_bd_pins UPC] [get_bd_pins and2_0/A]
connect_bd_net -net decoder_3to8_2_out2 [get_bd_pins JP] [get_bd_pins and2_0/B]
connect_bd_net -net decoder_3to8_2_out3 [get_bd_pins QJP] [get_bd_pins and2_1/B]
connect_bd_net -net decoder_3to8_2_out4 [get_bd_pins MJP] [get_bd_pins and2_2/B]
connect_bd_net [get_bd_pins or3_gate_0/y] [get_bd_pins y]

current_bd_instance /dlxzq7
connect_bd_net -net A1_1 [get_bd_pins A1] [get_bd_pins and2_2/A] [get_bd_pins and2_3/A]
connect_bd_net [get_bd_pins A] [get_bd_pins and2_1/A]
connect_bd_net -net B_1 [get_bd_pins YJP] [get_bd_pins and2_3/B]
connect_bd_net [get_bd_pins and2_0/Y] [get_bd_pins or3_gate_0/c]
connect_bd_net [get_bd_pins and2_1/Y] [get_bd_pins or3_gate_0/b]
connect_bd_net [get_bd_pins and2_2/Y] [get_bd_pins or3_gate_0/a]
connect_bd_net [get_bd_pins and2_3/Y] [get_bd_pins or3_gate_0/d]
connect_bd_net -net bit_splitter_23_0_bit8 [get_bd_pins UPC] [get_bd_pins and2_0/A]
connect_bd_net -net decoder_3to8_2_out2 [get_bd_pins JP] [get_bd_pins and2_0/B]
connect_bd_net -net decoder_3to8_2_out3 [get_bd_pins QJP] [get_bd_pins and2_1/B]
connect_bd_net -net decoder_3to8_2_out4 [get_bd_pins MJP] [get_bd_pins and2_2/B]
connect_bd_net [get_bd_pins or3_gate_0/y] [get_bd_pins y]

current_bd_instance /dlxzq8
connect_bd_net -net A1_1 [get_bd_pins A1] [get_bd_pins and2_2/A]
connect_bd_net -net A2_1 [get_bd_pins A2] [get_bd_pins and2_3/A]
connect_bd_net [get_bd_pins A] [get_bd_pins and2_1/A]
connect_bd_net -net B_1 [get_bd_pins YJP] [get_bd_pins and2_3/B]
connect_bd_net [get_bd_pins and2_0/Y] [get_bd_pins or3_gate_0/c]
connect_bd_net [get_bd_pins and2_1/Y] [get_bd_pins or3_gate_0/b]
connect_bd_net [get_bd_pins and2_2/Y] [get_bd_pins or3_gate_0/a]
connect_bd_net [get_bd_pins and2_3/Y] [get_bd_pins or3_gate_0/d]
connect_bd_net -net bit_splitter_23_0_bit8 [get_bd_pins UPC] [get_bd_pins and2_0/A]
connect_bd_net -net decoder_3to8_2_out2 [get_bd_pins JP] [get_bd_pins and2_0/B]
connect_bd_net -net decoder_3to8_2_out3 [get_bd_pins QJP] [get_bd_pins and2_1/B]
connect_bd_net -net decoder_3to8_2_out4 [get_bd_pins MJP] [get_bd_pins and2_2/B]
connect_bd_net [get_bd_pins or3_gate_0/y] [get_bd_pins y]

current_bd_instance /dlxzq9
connect_bd_net -net A1_1 [get_bd_pins A1] [get_bd_pins and2_2/A] [get_bd_pins and2_3/A]
connect_bd_net [get_bd_pins A] [get_bd_pins and2_1/A]
connect_bd_net -net B_1 [get_bd_pins YJP] [get_bd_pins and2_3/B]
connect_bd_net [get_bd_pins and2_0/Y] [get_bd_pins or3_gate_0/c]
connect_bd_net [get_bd_pins and2_1/Y] [get_bd_pins or3_gate_0/b]
connect_bd_net [get_bd_pins and2_2/Y] [get_bd_pins or3_gate_0/a]
connect_bd_net [get_bd_pins and2_3/Y] [get_bd_pins or3_gate_0/d]
connect_bd_net -net bit_splitter_23_0_bit8 [get_bd_pins UPC] [get_bd_pins and2_0/A]
connect_bd_net -net decoder_3to8_2_out2 [get_bd_pins JP] [get_bd_pins and2_0/B]
connect_bd_net -net decoder_3to8_2_out3 [get_bd_pins QJP] [get_bd_pins and2_1/B]
connect_bd_net -net decoder_3to8_2_out4 [get_bd_pins MJP] [get_bd_pins and2_2/B]
connect_bd_net [get_bd_pins or3_gate_0/y] [get_bd_pins y]

current_bd_instance /
connect_bd_net -net A1_1 [get_bd_pins splitter_12bit_to_12_0/out8] [get_bd_pins dlxzq8/A1]
connect_bd_net -net A1_2 [get_bd_pins splitter_12bit_to_12_0/out7] [get_bd_pins dlxzq7/A1]
connect_bd_net -net A1_3 [get_bd_pins splitter_12bit_to_12_0/out6] [get_bd_pins dlxzq6/A1]
connect_bd_net -net A1_4 [get_bd_pins splitter_12bit_to_12_0/out5] [get_bd_pins dlxzq5/A1]
connect_bd_net -net A1_5 [get_bd_pins splitter_12bit_to_12_0/out4] [get_bd_pins dlxzq4/A1]
connect_bd_net [get_bd_pins ALU/aggregated_output] [get_bd_ports ALU_out] [get_bd_pins Z/data_in]
connect_bd_net -net Busline_0_data_out [get_bd_pins mux_5to1_16bit_0/out] \
  [get_bd_pins ALU/data_16bit1] [get_bd_ports bus_out] [get_bd_pins R0/data_in] [get_bd_pins IR/data_in] \
  [get_bd_pins R1/data_in] [get_bd_pins R2/data_in] [get_bd_pins X/data_in] [get_bd_pins MDR/data_in] \
  [get_bd_pins bus_slicer_16to12_0/din] [get_bd_pins split_16to8_0/data_in]
connect_bd_net [get_bd_pins Crom_1kx23_0/data_out] [get_bd_pins bit_splitter_23_0/data_in] [get_bd_ports Crom_out]
connect_bd_net [get_bd_pins IR/data_out] [get_bd_ports IR_out] [get_bd_pins mux_5to1_16bit_0/IR] [get_bd_pins splitter_16bit_to_16_0/data_in]
connect_bd_net -net LD_1 [get_bd_pins decoder_3to8_2/out1] \
  [get_bd_pins uPC/LD] [get_bd_pins decoder_3to8_0/enable] [get_bd_pins decoder_3to8_1/enable] [get_bd_pins and2_1/A] \
  [get_bd_pins and2_2/B] [get_bd_pins and2_3/B] [get_bd_pins and2_4/A]
connect_bd_net [get_bd_pins MDRE/data_out] [get_bd_ports MDR_out] [get_bd_pins mux_5to1_16bit_0/MDR]
connect_bd_net [get_bd_pins MDR/data_out] [get_bd_pins ram_0/data_in]
connect_bd_net [get_bd_pins MUL/data_out] [get_bd_pins mux_5to1_16bit_0/MUL]
connect_bd_net [get_bd_pins PC/dout] [get_bd_ports PC_out] [get_bd_pins mux_5to1_16bit_0/PC]
connect_bd_net [get_bd_pins R0/data_out] [get_bd_ports R0_out] [get_bd_pins mux_5to1_16bit_0/R0]
connect_bd_net [get_bd_pins R1/data_out] [get_bd_ports R1_out] [get_bd_pins mux_5to1_16bit_0/R1]
connect_bd_net [get_bd_pins R2/data_out] [get_bd_ports R2_out] [get_bd_pins mux_5to1_16bit_0/R2]
connect_bd_net [get_bd_pins X/data_out] [get_bd_ports X_out] [get_bd_pins ALU/data_16bit]
connect_bd_net [get_bd_pins Z/data_out] [get_bd_pins mux_5to1_16bit_0/Z] [get_bd_ports Z_out]
connect_bd_net -net adpt_in_0_clk [get_bd_pins and_gate_1/y] \
  [get_bd_pins not_gate_0/a] [get_bd_pins uPC/clk] [get_bd_pins and2_0/A] [get_bd_pins splitter_12bit_to_12_0/clk_falling] \
  [get_bd_pins splitter_16bit_to_16_0/clk_falling]
connect_bd_net [get_bd_pins adpt_in_0/clk] [get_bd_pins and_gate_1/b]
connect_bd_net -net adpt_in_0_rst_n [get_bd_pins and_gate_0/y] \
  [get_bd_pins PC/CR] [get_bd_pins MAR/reset] [get_bd_pins MDRE/reset] [get_bd_pins R0/reset] [get_bd_pins IR/reset] \
  [get_bd_pins R1/reset] [get_bd_pins R2/reset] [get_bd_pins X/reset] [get_bd_pins MDR/reset] [get_bd_pins Z/reset] \
  [get_bd_pins uPC/CR] [get_bd_pins MUL/reset]
connect_bd_net [get_bd_pins adpt_in_0/rst_n] [get_bd_pins and_gate_0/b]
connect_bd_net [get_bd_pins aggregator_12inputs_0/aggregated_output] [get_bd_pins uPC/data_12bit]
connect_bd_net [get_bd_pins and2_0/Y] [get_bd_pins or_gate_1/b]
connect_bd_net [get_bd_pins and2_2/Y] [get_bd_pins Z/read_en]
connect_bd_net [get_bd_pins and2_3/Y] [get_bd_pins MUL/read_en]
connect_bd_net [get_bd_pins and2_4/Y] [get_bd_pins MDRE/read_en]
connect_bd_net [get_bd_pins bit_splitter_23_0/bit0] [get_bd_pins decoder_3to8_2/in0]
connect_bd_net [get_bd_pins bit_splitter_23_0/bit1] [get_bd_pins decoder_3to8_2/in1]
connect_bd_net [get_bd_pins bit_splitter_23_0/bit2] [get_bd_pins decoder_3to8_2/in2]
connect_bd_net [get_bd_pins bit_splitter_23_0/bit3] [get_bd_pins not1_0/A]
connect_bd_net [get_bd_pins bit_splitter_23_0/bit4] [get_bd_pins decoder_2to4_1/in0]
connect_bd_net [get_bd_pins bit_splitter_23_0/bit5] [get_bd_pins decoder_2to4_1/in1]
connect_bd_net [get_bd_pins bit_splitter_23_0/bit6] [get_bd_pins decoder_3to8_1/in0]
connect_bd_net [get_bd_pins bit_splitter_23_0/bit7] [get_bd_pins decoder_3to8_1/in1]
connect_bd_net [get_bd_pins bit_splitter_23_0/bit8] [get_bd_pins decoder_3to8_1/in2] [get_bd_pins dlxzq0/UPC]
connect_bd_net [get_bd_pins bit_splitter_23_0/bit9] [get_bd_pins dlxzq1/UPC] [get_bd_pins MDRE/clk] [get_bd_pins and2_4/B]
connect_bd_net [get_bd_pins bit_splitter_23_0/bit10] [get_bd_pins dlxzq2/UPC] [get_bd_pins Z/clk] [get_bd_pins and2_2/A]
connect_bd_net [get_bd_pins bit_splitter_23_0/bit11] [get_bd_pins decoder_2to4_0/in0] [get_bd_pins dlxzq3/UPC]
connect_bd_net [get_bd_pins bit_splitter_23_0/bit12] [get_bd_pins decoder_2to4_0/in1] [get_bd_pins dlxzq4/UPC]
connect_bd_net [get_bd_pins bit_splitter_23_0/bit13] [get_bd_pins decoder_3to8_0/in0] [get_bd_pins dlxzq5/UPC]
connect_bd_net [get_bd_pins bit_splitter_23_0/bit14] [get_bd_pins decoder_3to8_0/in1] [get_bd_pins dlxzq6/UPC]
connect_bd_net [get_bd_pins bit_splitter_23_0/bit15] [get_bd_pins decoder_3to8_0/in2] [get_bd_pins dlxzq7/UPC]
connect_bd_net [get_bd_pins bit_splitter_23_0/bit16] [get_bd_pins dlxzq8/UPC]
connect_bd_net [get_bd_pins bit_splitter_23_0/bit17] [get_bd_pins dlxzq9/UPC] [get_bd_pins ALU/cin]
connect_bd_net [get_bd_pins bit_splitter_23_0/bit22] [get_bd_pins ALU/m]
connect_bd_net [get_bd_pins bit_splitter_23_0/merged_21_18] [get_bd_pins ALU/s]
connect_bd_net [get_bd_ports btn_clk] [get_bd_pins adpt_in_0/btn_clk]
connect_bd_net [get_bd_ports btn_rst] [get_bd_pins adpt_in_0/btn_rst]
connect_bd_net [get_bd_pins bus_slicer_16to12_0/dout] [get_bd_pins MAR/data_in] [get_bd_pins PC/data_12bit]
connect_bd_net -net clk_1 [get_bd_pins or_gate_1/y] [get_bd_pins and2_1/B]
connect_bd_net -net clk_2 [get_bd_pins and2_1/Y] [get_bd_pins PC/clk] [get_bd_ports CK1]
connect_bd_net [get_bd_pins decoder_2to4_0/out1] [get_bd_pins or_gate_1/a]
connect_bd_net [get_bd_pins decoder_2to4_0/out2] [get_bd_pins not_gate_1/a] [get_bd_pins and2_0/B]
connect_bd_net [get_bd_pins decoder_2to4_0/out3] [get_bd_pins and2_3/A]
connect_bd_net [get_bd_pins decoder_2to4_1/out1] [get_bd_pins or_gate_0/b]
connect_bd_net [get_bd_pins decoder_2to4_1/out2] [get_bd_pins or_gate_0/a] [get_bd_pins ram_0/we]
connect_bd_net [get_bd_pins decoder_2to4_1/out3] [get_bd_pins mux_5to1_16bit_0/selMUL]
connect_bd_net [get_bd_pins decoder_3to8_0/out1] [get_bd_pins mux_5to1_16bit_0/selIR]
connect_bd_net [get_bd_pins decoder_3to8_0/out2] [get_bd_pins mux_5to1_16bit_0/selR0]
connect_bd_net [get_bd_pins decoder_3to8_0/out3] [get_bd_pins mux_5to1_16bit_0/selR1]
connect_bd_net [get_bd_pins decoder_3to8_0/out4] [get_bd_pins mux_5to1_16bit_0/selR2]
connect_bd_net [get_bd_pins decoder_3to8_0/out5] [get_bd_pins mux_5to1_16bit_0/selZ]
connect_bd_net [get_bd_pins decoder_3to8_0/out6] [get_bd_pins mux_5to1_16bit_0/selMDR]
connect_bd_net [get_bd_pins decoder_3to8_0/out7] [get_bd_pins mux_5to1_16bit_0/selPC]
connect_bd_net [get_bd_pins decoder_3to8_1/out1] [get_bd_pins IR/clk] [get_bd_pins IR/read_en]
connect_bd_net [get_bd_pins decoder_3to8_1/out2] [get_bd_pins R0/clk] [get_bd_pins R0/read_en]
connect_bd_net [get_bd_pins decoder_3to8_1/out3] [get_bd_pins R1/clk] [get_bd_pins R1/read_en]
connect_bd_net [get_bd_pins decoder_3to8_1/out4] [get_bd_pins R2/clk] [get_bd_pins R2/read_en]
connect_bd_net [get_bd_pins decoder_3to8_1/out5] [get_bd_pins X/clk] [get_bd_pins X/read_en]
connect_bd_net [get_bd_pins decoder_3to8_1/out6] [get_bd_pins MAR/clk] [get_bd_pins MAR/read_en]
connect_bd_net [get_bd_pins decoder_3to8_1/out7] [get_bd_pins MDR/clk] [get_bd_pins MDR/read_en]
connect_bd_net [get_bd_pins decoder_3to8_2/out2] \
  [get_bd_pins dlxzq0/JP] [get_bd_pins dlxzq1/JP] [get_bd_pins dlxzq2/JP] [get_bd_pins dlxzq3/JP] [get_bd_pins dlxzq4/JP] \
  [get_bd_pins dlxzq5/JP] [get_bd_pins dlxzq6/JP] [get_bd_pins dlxzq7/JP] [get_bd_pins dlxzq8/JP] [get_bd_pins dlxzq9/JP]
connect_bd_net [get_bd_pins decoder_3to8_2/out3] \
  [get_bd_pins dlxzq0/QJP] [get_bd_pins dlxzq1/QJP] [get_bd_pins dlxzq2/QJP] [get_bd_pins dlxzq3/QJP] \
  [get_bd_pins dlxzq4/QJP] [get_bd_pins dlxzq5/QJP] [get_bd_pins dlxzq6/QJP] [get_bd_pins dlxzq7/QJP] \
  [get_bd_pins dlxzq8/QJP] [get_bd_pins dlxzq9/QJP]
connect_bd_net [get_bd_pins decoder_3to8_2/out4] \
  [get_bd_pins dlxzq0/MJP] [get_bd_pins dlxzq1/MJP] [get_bd_pins dlxzq2/MJP] [get_bd_pins dlxzq3/MJP] \
  [get_bd_pins dlxzq4/MJP] [get_bd_pins dlxzq5/MJP] [get_bd_pins dlxzq6/MJP] [get_bd_pins dlxzq7/MJP] \
  [get_bd_pins dlxzq8/MJP] [get_bd_pins dlxzq9/MJP]
connect_bd_net [get_bd_pins decoder_3to8_2/out5] \
  [get_bd_pins dlxzq9/YJP] [get_bd_pins dlxzq8/YJP] [get_bd_pins dlxzq7/YJP] [get_bd_pins dlxzq6/YJP] \
  [get_bd_pins dlxzq5/YJP] [get_bd_pins dlxzq4/YJP] [get_bd_pins dlxzq3/YJP] [get_bd_pins dlxzq2/YJP] \
  [get_bd_pins dlxzq1/YJP]
connect_bd_net [get_bd_pins dlxzq0/y] [get_bd_pins aggregator_12inputs_0/in0]
connect_bd_net [get_bd_pins dlxzq1/y] [get_bd_pins aggregator_12inputs_0/in1]
connect_bd_net [get_bd_pins dlxzq2/y] [get_bd_pins aggregator_12inputs_0/in2]
connect_bd_net [get_bd_pins dlxzq3/y] [get_bd_pins aggregator_12inputs_0/in3]
connect_bd_net [get_bd_pins dlxzq4/y] [get_bd_pins aggregator_12inputs_0/in4]
connect_bd_net [get_bd_pins dlxzq5/y] [get_bd_pins aggregator_12inputs_0/in5]
connect_bd_net [get_bd_pins dlxzq6/y] [get_bd_pins aggregator_12inputs_0/in6]
connect_bd_net [get_bd_pins dlxzq7/y] [get_bd_pins aggregator_12inputs_0/in7]
connect_bd_net [get_bd_pins dlxzq8/y] [get_bd_pins aggregator_12inputs_0/in8]
connect_bd_net [get_bd_pins dlxzq9/y] [get_bd_pins aggregator_12inputs_0/in9]
connect_bd_net [get_bd_pins multiplier_8x8_0/p] [get_bd_pins MUL/data_in]
connect_bd_net [get_bd_pins not1_0/Y] [get_bd_pins uPC/CT_p] [get_bd_pins and_gate_0/a] [get_bd_pins and_gate_1/a]
connect_bd_net [get_bd_pins not_gate_0/y] [get_bd_pins Crom_1kx23_0/clk]
connect_bd_net [get_bd_pins not_gate_1/y] [get_bd_pins PC/LD]
connect_bd_net [get_bd_pins or_gate_0/y] [get_bd_pins ram_0/clk]
connect_bd_net [get_bd_pins ram_0/data_out] [get_bd_ports RAM_out] [get_bd_pins MDRE/data_in]
connect_bd_net -net register_12bit_0_data_out [get_bd_pins MAR/data_out] [get_bd_ports MAR_out] [get_bd_pins ram_0/addr]
connect_bd_net [get_bd_pins split_16to8_0/data_high] [get_bd_pins multiplier_8x8_0/a]
connect_bd_net [get_bd_pins split_16to8_0/data_low] [get_bd_pins multiplier_8x8_0/b]
connect_bd_net [get_bd_pins splitter_12bit_to_12_0/out9] [get_bd_pins dlxzq9/A1]
connect_bd_net [get_bd_pins splitter_16bit_to_16_0/out0] [get_bd_pins dlxzq1/A1]
connect_bd_net [get_bd_pins splitter_16bit_to_16_0/out1] [get_bd_pins dlxzq2/A1]
connect_bd_net [get_bd_pins splitter_16bit_to_16_0/out5] [get_bd_pins dlxzq1/A]
connect_bd_net [get_bd_pins splitter_16bit_to_16_0/out6] [get_bd_pins dlxzq2/A]
connect_bd_net [get_bd_pins splitter_16bit_to_16_0/out10] [get_bd_pins dlxzq4/A]
connect_bd_net [get_bd_pins splitter_16bit_to_16_0/out11] [get_bd_pins dlxzq5/A]
connect_bd_net [get_bd_pins splitter_16bit_to_16_0/out12] [get_bd_pins dlxzq6/A]
connect_bd_net [get_bd_pins splitter_16bit_to_16_0/out13] [get_bd_pins dlxzq7/A]
connect_bd_net [get_bd_pins splitter_16bit_to_16_0/out14] [get_bd_pins dlxzq8/A]
connect_bd_net [get_bd_pins splitter_16bit_to_16_0/out15] [get_bd_pins dlxzq9/A]
connect_bd_net [get_bd_pins uPC/dout] [get_bd_ports upc_dout] [get_bd_pins splitter_12bit_to_12_0/data_in] [get_bd_pins Crom_1kx23_0/addr]
connect_bd_net -net xlconstant_0_dout [get_bd_pins xlconstant_1/dout] \
  [get_bd_pins PC/CT_p] [get_bd_pins decoder_2to4_0/enable] [get_bd_pins decoder_2to4_1/enable] \
  [get_bd_pins decoder_3to8_2/enable] [get_bd_pins MAR/write_en] [get_bd_pins MDRE/write_en] [get_bd_pins R0/write_en] \
  [get_bd_pins IR/write_en] [get_bd_pins R1/write_en] [get_bd_pins R2/write_en] [get_bd_pins X/write_en] \
  [get_bd_pins MDR/write_en] [get_bd_pins Z/write_en] [get_bd_pins dlxzq3/A] [get_bd_pins dlxzq8/A2] [get_bd_pins dlxzq3/A1] \
  [get_bd_pins MUL/write_en] [get_bd_pins MUL/clk] [get_bd_pins Crom_1kx23_0/en]

validate_bd_design
save_bd_design
